# Altium schematic sheet BalEv_SD_card_v1_0.SchDoc
size A4; CompanyName: HESSO; Address1: Route du Rawyl 47; Address2: 1950 Sion; Address3: Switzerland; DocumentNumber: 5; SheetNumber: 1; SheetTotal: 8; PageSetup: Record=PageOptions|CenterHorizontal=True|CenterVertical=True|PrintScale=1.00|XCorrection=1.00|YCorrection=1.00|PrintKind=1|BorderSize=5000000|LeftOffset=0|BottomOffset=0|Orientation=2|PaperLength=1000|PaperWidth=1000|Scale=100|PaperSource=15|PrintQuality=1200|MediaType=1|DitherType=10|PrintScaleMode=1|PaperKind=A4|PaperIndex=9; ProjectName: Project Name
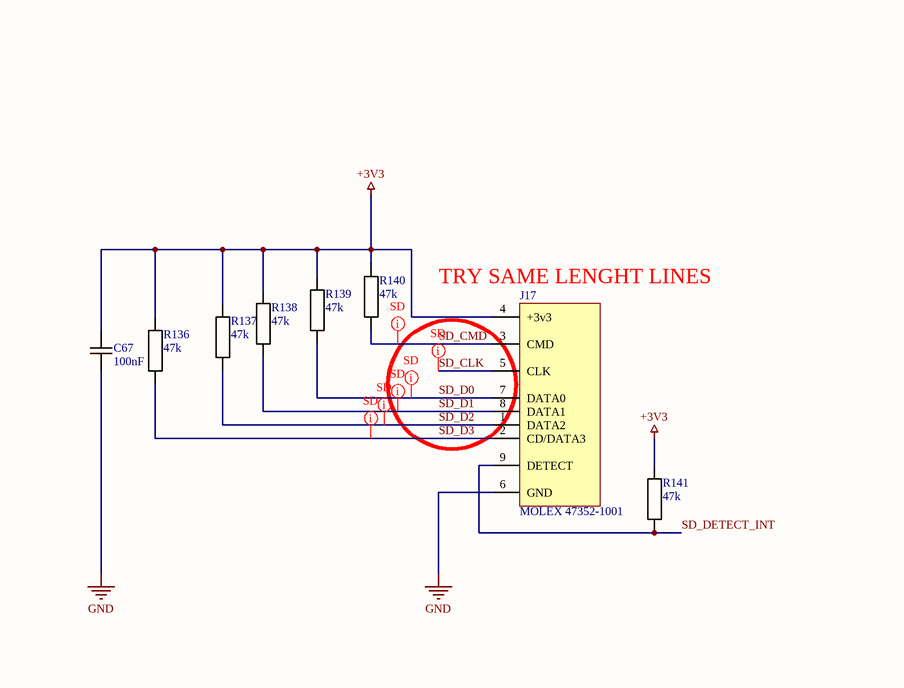
[diagram p0: BalEv_SD_card_v1_0.SchDoc]

## Parts
C67  100nF  [CAPACITOR 1005 REFLOW]
J17  MOLEX 47352-1001  [SD MICRO MOLEX 47352-1001]
R136  47k  [RESISTOR 1005 REFLOW]
R137  47k  [RESISTOR 1005 REFLOW]
R138  47k  [RESISTOR 1005 REFLOW]
R139  47k  [RESISTOR 1005 REFLOW]
R140  47k  [RESISTOR 1005 REFLOW]
R141  47k  [RESISTOR 1005 REFLOW]

## Nets
+3V3: C67.2 J17.4(+3v3) R136.2 R137.2 R138.2 R139.2 R140.2 R141.2
GND: C67.1 J17.6(GND)
SD_CLK: J17.5(CLK)
SD_CMD: J17.3(CMD) R140.1
SD_D0: J17.7(DATA0) R139.1
SD_D1: J17.8(DATA1) R138.1
SD_D2: J17.1(DATA2) R137.1
SD_D3: J17.2(CD/DATA3) R136.1
SD_DETECT_INT: J17.9(DETECT) R141.1

## Layout directives
net class SD; rule Matched Net Lengths [Tolerance = 1mm]: SD_CLK, SD_CMD, SD_D0, SD_D1, SD_D2, SD_D3

## Notes on the sheet
- (near J17) TRY SAME LENGHT LINES
- Date :
- Revision :
- Sheet
- of
- Design by :

## Library data of the parts
C67 = Capacitor: Value: 100nF; STOCK: NO
J17 = SD-MICRO MOLEX 47352-1001: SD Card  Micro 47352-1001; Value: MOLEX 47352-1001; STOCK: YES
R136-R141 = Resistor: Value: 47k; STOCK: NO